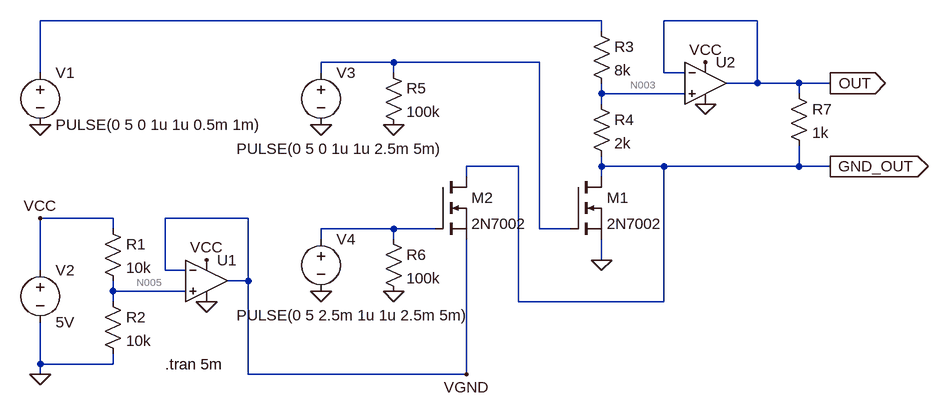
[diagram p0: schematic R-Split-VGND.asc]
R-Split-VGND.asc, the LTspice schematic file:
Version 4
SHEET 1 1216 680
WIRE 672 -144 -192 -144
WIRE 912 -144 768 -144
WIRE 672 -128 672 -144
WIRE 352 -80 240 -80
WIRE 576 -80 352 -80
WIRE -192 -64 -192 -144
WIRE 240 -64 240 -80
WIRE 352 -64 352 -80
WIRE 768 -64 768 -144
WIRE 800 -64 768 -64
WIRE 912 -48 912 -144
WIRE 912 -48 864 -48
WIRE 976 -48 912 -48
WIRE 1024 -48 976 -48
WIRE 672 -32 672 -48
WIRE 800 -32 672 -32
WIRE 976 -32 976 -48
WIRE 672 -16 672 -32
WIRE 544 80 464 80
WIRE 672 80 672 64
WIRE 768 80 672 80
WIRE 976 80 976 48
WIRE 976 80 768 80
WIRE 1024 80 976 80
WIRE 464 96 464 80
WIRE 672 96 672 80
WIRE -80 160 -192 160
WIRE 128 160 0 160
WIRE -80 176 -80 160
WIRE 352 176 240 176
WIRE 416 176 352 176
WIRE 576 176 576 -80
WIRE 624 176 576 176
WIRE 240 192 240 176
WIRE 352 192 352 176
WIRE 672 224 672 192
WIRE -192 240 -192 160
WIRE 0 240 0 160
WIRE 32 240 0 240
WIRE 128 256 128 160
WIRE 128 256 96 256
WIRE -80 272 -80 256
WIRE 32 272 -80 272
WIRE -80 288 -80 272
WIRE 544 288 544 80
WIRE 768 288 768 80
WIRE 768 288 544 288
WIRE -192 384 -192 320
WIRE -80 384 -80 368
WIRE -80 384 -192 384
WIRE -192 400 -192 384
WIRE 128 400 128 256
WIRE 464 400 464 192
WIRE 464 400 128 400
FLAG -192 400 0
FLAG -192 16 0
FLAG 1024 -48 OUT
IOPIN 1024 -48 Out
FLAG 64 288 0
FLAG -192 160 VCC
FLAG 64 224 VCC
FLAG 672 224 0
FLAG 240 16 0
FLAG 352 16 0
FLAG 240 272 0
FLAG 352 272 0
FLAG 832 -80 VCC
FLAG 832 -16 0
FLAG 464 400 VGND
FLAG 1024 80 GND_OUT
IOPIN 1024 80 Out
SYMBOL voltage -192 -80 R0
WINDOW 123 0 0 Left 2
WINDOW 39 0 0 Left 2
SYMATTR InstName V1
SYMATTR Value PULSE(0 5 0 1u 1u 0.5m 1m)
SYMBOL voltage -192 224 R0
WINDOW 123 0 0 Left 2
WINDOW 39 0 0 Left 2
SYMATTR InstName V2
SYMATTR Value 5V
SYMBOL res -96 160 R0
SYMATTR InstName R1
SYMATTR Value 10k
SYMBOL res -96 272 R0
SYMATTR InstName R2
SYMATTR Value 10k
SYMBOL res 656 -144 R0
SYMATTR InstName R3
SYMATTR Value 8k
SYMBOL res 656 -32 R0
SYMATTR InstName R4
SYMATTR Value 2k
SYMBOL Opamps\\UniversalOpamp2 64 256 R0
SYMATTR InstName U1
SYMBOL voltage 240 -80 R0
WINDOW 3 -130 133 Left 2
WINDOW 123 0 0 Left 2
WINDOW 39 0 0 Left 2
SYMATTR InstName V3
SYMATTR Value PULSE(0 5 0 1u 1u 2.5m 5m)
SYMBOL res 336 -80 R0
SYMATTR InstName R5
SYMATTR Value 100k
SYMBOL voltage 240 176 R0
WINDOW 3 -130 133 Left 2
WINDOW 123 0 0 Left 2
WINDOW 39 0 0 Left 2
SYMATTR InstName V4
SYMATTR Value PULSE(0 5 2.5m 1u 1u 2.5m 5m)
SYMBOL res 336 176 R0
SYMATTR InstName R6
SYMATTR Value 100k
SYMBOL nmos 624 96 R0
SYMATTR InstName M1
SYMATTR Value 2N7002
SYMBOL nmos 416 96 R0
SYMATTR InstName M2
SYMATTR Value 2N7002
SYMBOL Opamps\\UniversalOpamp2 832 -48 R0
SYMATTR InstName U2
SYMBOL res 960 -48 R0
SYMATTR InstName R7
SYMATTR Value 1k
TEXT 0 384 Left 2 !.tran 5m

The netlist it stands for:
* R-Split-VGND.asc
V1 N001 0 PULSE(0 5 0 1u 1u 0.5m 1m)
V2 VCC 0 5V
R1 VCC N005 10k
R2 N005 0 10k
R3 N001 N003 8k
R4 N003 GND_OUT 2k
XU1 N005 VGND VCC 0 VGND level.2 Avol=1Meg GBW=10Meg Slew=10Meg ilimit=25m rail=0 Vos=0 phimargin=45 en=0 enk=0 in=0 ink=0 Rin=500Meg  ; pins IN+ IN- V+ V- OUT
V3 N002 0 PULSE(0 5 0 1u 1u 2.5m 5m)
R5 N002 0 100k
V4 N004 0 PULSE(0 5 2.5m 1u 1u 2.5m 5m)
R6 N004 0 100k
M1 GND_OUT N002 0 0 2N7002
M2 GND_OUT N004 VGND VGND 2N7002
XU2 N003 OUT VCC 0 OUT level.2 Avol=1Meg GBW=10Meg Slew=10Meg ilimit=25m rail=0 Vos=0 phimargin=45 en=0 enk=0 in=0 ink=0 Rin=500Meg  ; pins IN+ IN- V+ V- OUT
R7 OUT GND_OUT 1k
.model NMOS NMOS
.model PMOS PMOS
.lib standard.mos
.tran 5m
.lib UniversalOpamps2.sub
.backanno
.end

* Results of the author's LTspice run, read from the files saved beside the schematic
* Operating Point, zero values left out:
*   V(vcc) = 5 V
*   V(n005) = 2.5 V
*   V(n003) = 1.516 V
*   V(gnd_out) = 1.895 V
*   V(vgnd) = 2.5 V
*   V(out) = 1.516 V
*   Id(M2) = -568.6 µA
*   Is(M2) = 568.6 µA
*   Id(M1) = 1.933 pA
*   Is(M1) = -1.933 pA
*   I(R7) = -379 µA
*   I(R4) = -189.5 µA
*   I(R3) = -189.5 µA
*   I(R2) = 250 µA
*   I(R1) = 250 µA
*   I(V2) = -1.021 mA
*   I(V1) = 189.5 µA
*   Ix(u1:3) = 662.9 µA
*   Ix(u1:4) = -94.29 µA
*   Ix(u1:5) = -568.6 µA
*   Ix(u2:1) = -1.968 nA
*   Ix(u2:2) = -1.968 nA
*   Ix(u2:3) = 108.4 µA
*   Ix(u2:4) = -487.4 µA
*   Ix(u2:5) = 379.1 µA
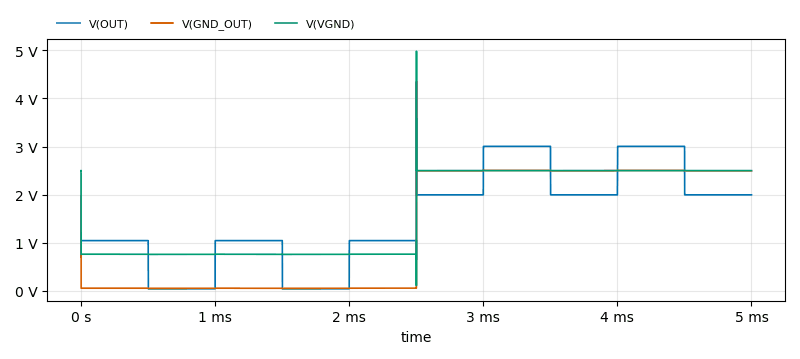
[diagram p1: Transient Analysis of R-Split-VGND.asc, plotted from the saved traces]
* Transient Analysis, 1 run:
*   V(OUT): min 43.62 mV, max 3.575 V, average 1.523 V, rms 1.825 V, last 1.996 V
*   V(GND_OUT): min 53.74 mV, max 4.353 V, average 1.277 V, rms 1.767 V, last 2.496 V
*   V(VGND): min 110.7 mV, max 4.98 V, average 1.631 V, rms 1.848 V, last 2.5 V